# EAGLE design carte suiveur (EAGLE 5.12)
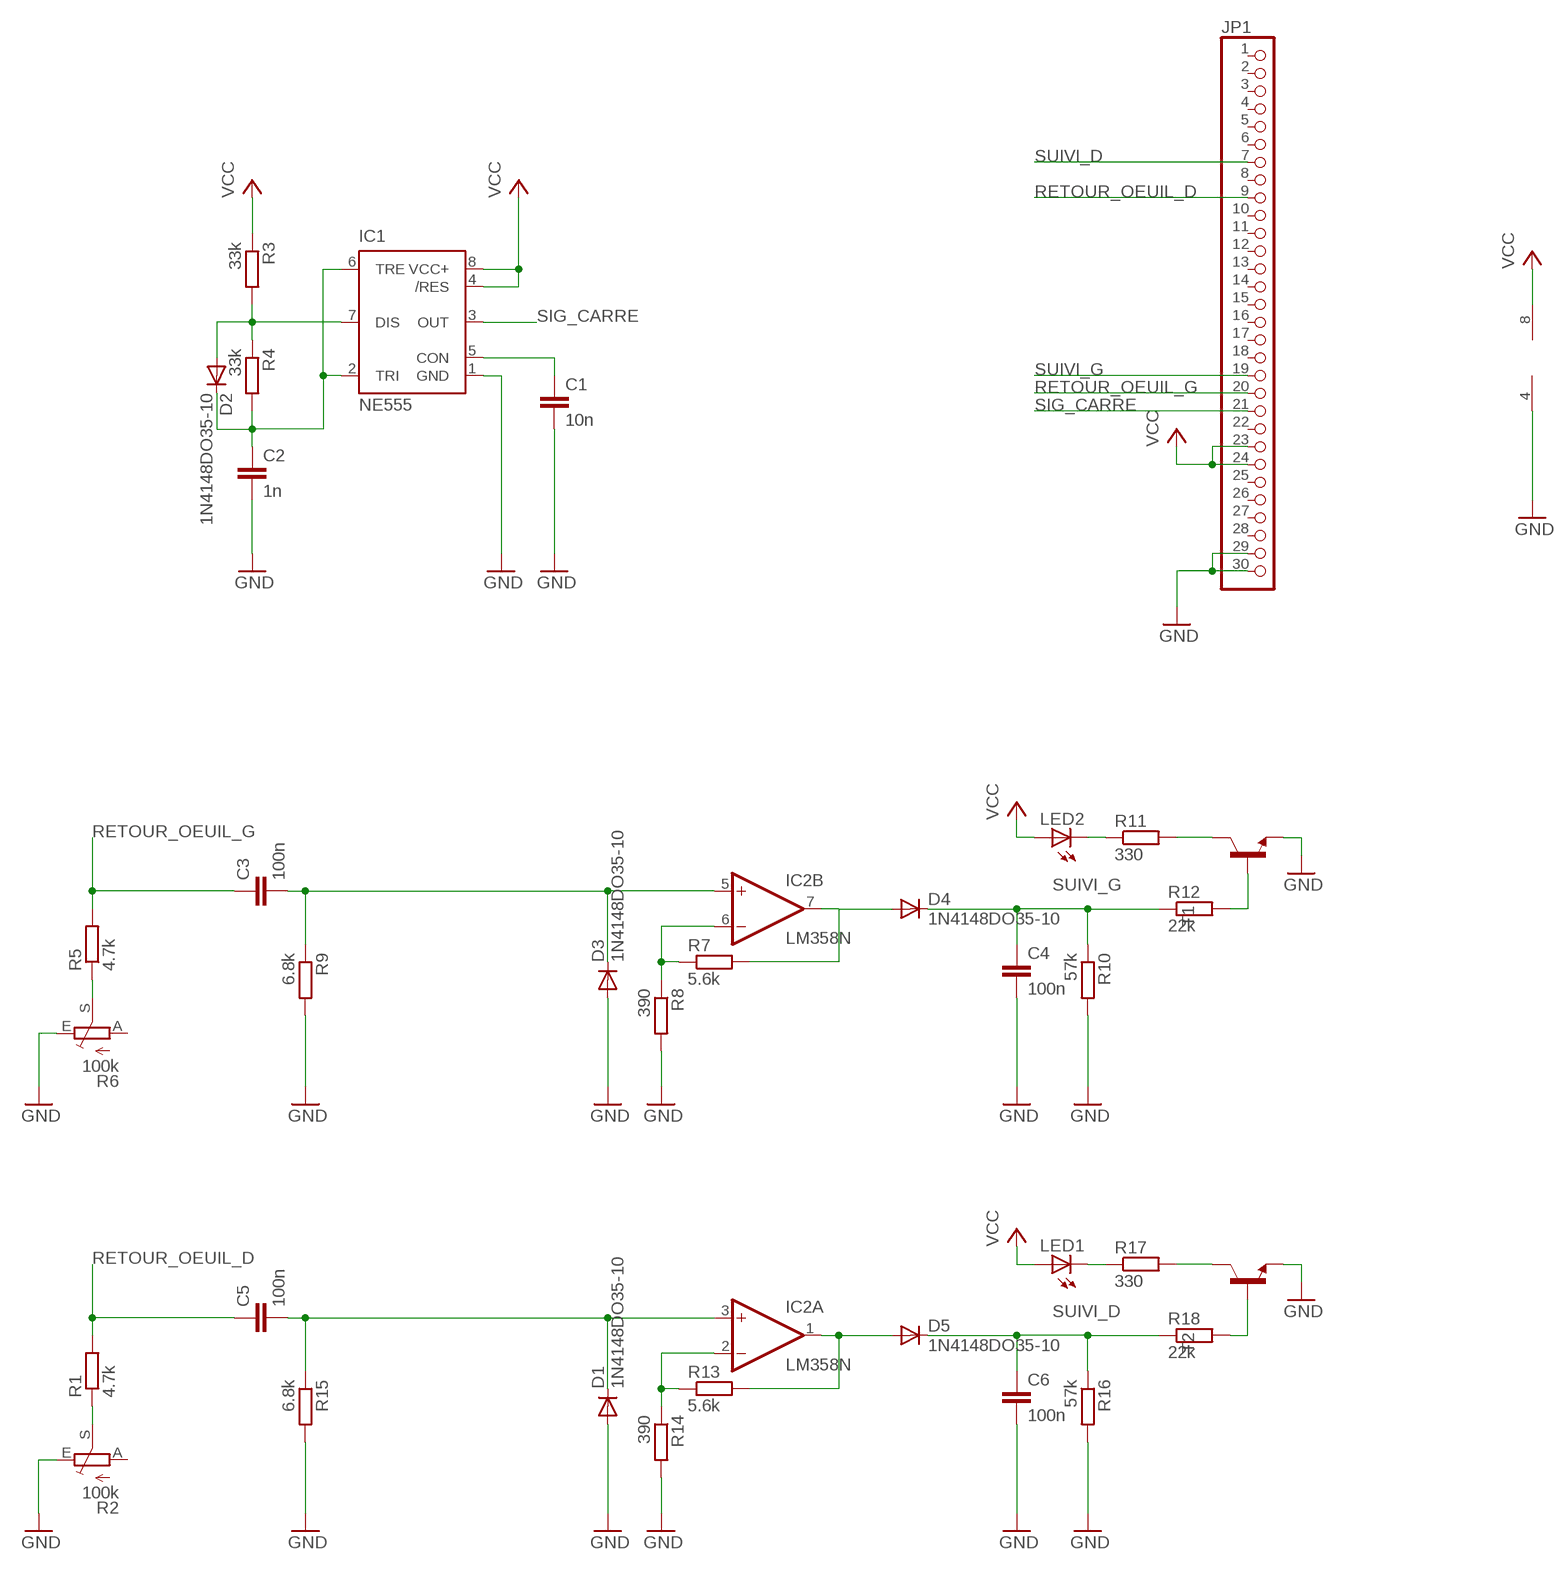
[diagram p0: schematic, sheet 1]

## Parts
C1  10n  C-EU025-025X050  [C025-025X050]
C2  1n  C-EU102-043X133  [C102-043X133]
C3  100n  C-EU025-025X050  [C025-025X050]
C4  100n  C-EU025-025X050  [C025-025X050]
C5  100n  C-EU025-025X050  [C025-025X050]
C6  100n  C-EU025-025X050  [C025-025X050]
D1  1N4148DO35-10  [DO35-10]
D2  1N4148DO35-10  [DO35-10]
D3  1N4148DO35-10  [DO35-10]
D4  1N4148DO35-10  [DO35-10]
D5  1N4148DO35-10  [DO35-10]
IC1  NE555  [DIL-08]
IC2  LM358N  [DIL08]
JP1  PINHD-1X30  [1X30]
LED1  LED3MM  [LED3MM]
LED2  LED3MM  [LED3MM]
R1  4.7k  R-EU_0207/10  [0207/10]
R2  100k  TRIM_EU-CA9V  [CA9V]
R3  33k  R-EU_0207/10  [0207/10]
R4  33k  R-EU_0207/10  [0207/10]
R5  4.7k  R-EU_0207/10  [0207/10]
R6  100k  TRIM_EU-CA9V  [CA9V]
R7  5.6k  R-EU_0207/10  [0207/10]
R8  390  R-EU_0207/10  [0207/10]
R9  6.8k  R-EU_0207/10  [0207/10]
R10  57k  R-EU_0207/10  [0207/10]
R11  330  R-EU_0207/10  [0207/10]
R12  22k  R-EU_0207/10  [0207/10]
R13  5.6k  R-EU_0207/10  [0207/10]
R14  390  R-EU_0207/10  [0207/10]
R15  6.8k  R-EU_0207/10  [0207/10]
R16  57k  R-EU_0207/10  [0207/10]
R17  330  R-EU_0207/10  [0207/10]
R18  22k  R-EU_0207/10  [0207/10]
T1  2N2222-NPN-TO92-EBC  [TO92-EBC]
T2  2N2222-NPN-TO92-EBC  [TO92-EBC]

## Nets
GND: C1.2 C2.2 C4.2 C6.2 D1.A D3.A IC1.1(GND) IC2.4(P:V-) JP1.29 JP1.30 R2.E R6.E R8.2 R9.2 R10.2 R14.2 R15.2 R16.2 T1.E T2.E
N$1: LED1.K(C) R17.1
N$2: D2.A IC1.7(DIS) R3.2 R4.1
N$3: C2.1 D2.C IC1.2(TRI) IC1.6(TRE) R4.2
N$4: C1.1 IC1.5(CON)
N$5: C5.2 D1.C IC2.3(A:+IN) R15.1
N$6: IC2.2(A:-IN) R13.1 R14.1
N$7: C3.2 D3.C IC2.5(B:+IN) R9.1
N$8: IC2.6(B:-IN) R7.1 R8.1
N$9: D4.A IC2.7(B:OUT) R7.2
N$10: R5.1 R6.S
N$12: D5.A IC2.1(A:OUT) R13.2
N$13: R1.1 R2.S
N$14: R11.2 T1.C
N$16: R17.2 T2.C
N$17: LED2.K(C) R11.1
N$18: R18.2 T2.B
N$19: R12.2 T1.B
RETOUR_OEUIL_D: C5.1 JP1.9 R1.2
RETOUR_OEUIL_G: C3.1 JP1.20 R5.2
SIG_CARRE: IC1.3(OUT) JP1.21
SUIVI_D: C6.1 D5.C JP1.7 R16.1 R18.1
SUIVI_G: C4.1 D4.C JP1.19 R10.1 R12.1
VCC: IC1.4(/RES) IC1.8(VCC+) IC2.8(P:V+) JP1.23 JP1.24 LED1.A LED2.A R3.1
Unconnected: JP1.1 JP1.2 JP1.3 JP1.4 JP1.5 JP1.6 JP1.8 JP1.10 JP1.11 JP1.12 JP1.13 JP1.14 JP1.15 JP1.16 JP1.17 JP1.18 JP1.22 JP1.25 JP1.26 JP1.27 JP1.28 R2.A R6.A

## Library data of the parts
C1-C6 = resistor:C-EU: CAPACITOR, European symbol
D1-D5 = diode:1N4148: DIODE high speed (Philips)
IC1 = st-microelectronics:NE555: General purpose bipolar Timer; MF: Arrow Electronics; MPN: NE555N; OC_FARNELL: 1467742; OC_NEWARK: 89K1486
IC2 = linear:LM358: OP AMP also LM158; LM258; LM2904 Source: http://cache.national.com/ds/LM/LM158.pdf
JP1 = pinhead:PINHD-1X30: PIN HEADER
LED1 LED2 = led:LED: LED OSRAM: - CHIPLED LG R971, LG N971, LY N971, LG Q971, LY Q971, LO R971, LY R971 LH N974, LH R974 LS Q976, LO Q976, LY Q976 LO Q996 - Hyper CHIPLED LW Q18S LB Q993, LB Q99A, LB R99A - SideLED LS A670, LO A670, LY A670, LG A670, LP A670 LB A673, LV A673, LT A673, LW A673 LH A674 LY A675 LS A676, LA A676, LO A676, LY A676, LW A676 LS A679, LY A679, LG A679 - Hyper Micro SIDELED® LS Y876, LA Y876, LO Y876, LY Y876 LT Y87S - SmartLED LW L88C, LW L88S LB L89C, LB L89S, LG L890 LS L89K, LO L89K, LY L89K LS L896, LA L896, LO L896, LY L896 - TOPLED LS T670, LO T670, LY T670, LG T670, LP T670 LSG T670, LSP T670, LSY T670, LOP T670, LYG T670 LG T671, LOG T671, LSG T671 LB T673, LV T673, LT T673, LW T673 LH T674 LS T676, LA T676, LO T676, LY T676, LB T676, LH T676, LSB T676, LW T676 LB T67C, LV T67C, LT T67C, LS T67K, LO T67K, LY T67K, LW E67C LS E67B, LA E67B, LO E67B, LY E67B, LB E67C, LV E67C, LT E67C LW T67C LS T679, LY T679, LG T679 LS T770, LO T770, LY T770, LG T770, LP T770 LB T773, LV T773, LT T773, LW T773 LH T774 LS E675, LA E675, LY E675, LS T675 LS T776, LA T776, LO T776, LY T776, LB T776 LHGB T686 LT T68C, LB T68C - Hyper Mini TOPLED® LB M676 - Mini TOPLED Santana® LG M470 LS M47K, LO M47K, LY M47K Source: http://www.osram.convergy.de LUXEON: - LUMILED® LXK2-PW12-R00, LXK2-PW12-S00, LXK2-PW14-U00, LXK2-PW14-V00 LXK2-PM12-R00, LXK2-PM12-S00, LXK2-PM14-U00 LXK2-PE12-Q00, LXK2-PE12-R00, LXK2-PE12-S00, LXK2-PE14-T00, LXK2-PE14-U00 LXK2-PB12-K00, LXK2-PB12-L00, LXK2-PB12-M00, LXK2-PB14-N00, LXK2-PB14-P00, LXK2-PB14-Q00 LXK2-PR12-L00, LXK2-PR12-M00, LXK2-PR14-Q00, LXK2-PR14-R00 LXK2-PD12-Q00, LXK2-PD12-R00, LXK2-PD12-S00 LXK2-PH12-R00, LXK2-PH12-S00 LXK2-PL12-P00, LXK2-PL12-Q00, LXK2-PL12-R00 Source: www.luxeon.com KINGBRIGHT: KA-3528ASYC Source: www.kingbright.com
R1 R3-R5 R7-R18 = resistor:R-EU_: RESISTOR, European symbol
R2 R6 = pot:TRIM_EU-: POTENTIOMETER
T1 T2 = transistor-neu-to92:*-NPN-: NPN Transistror

## Board
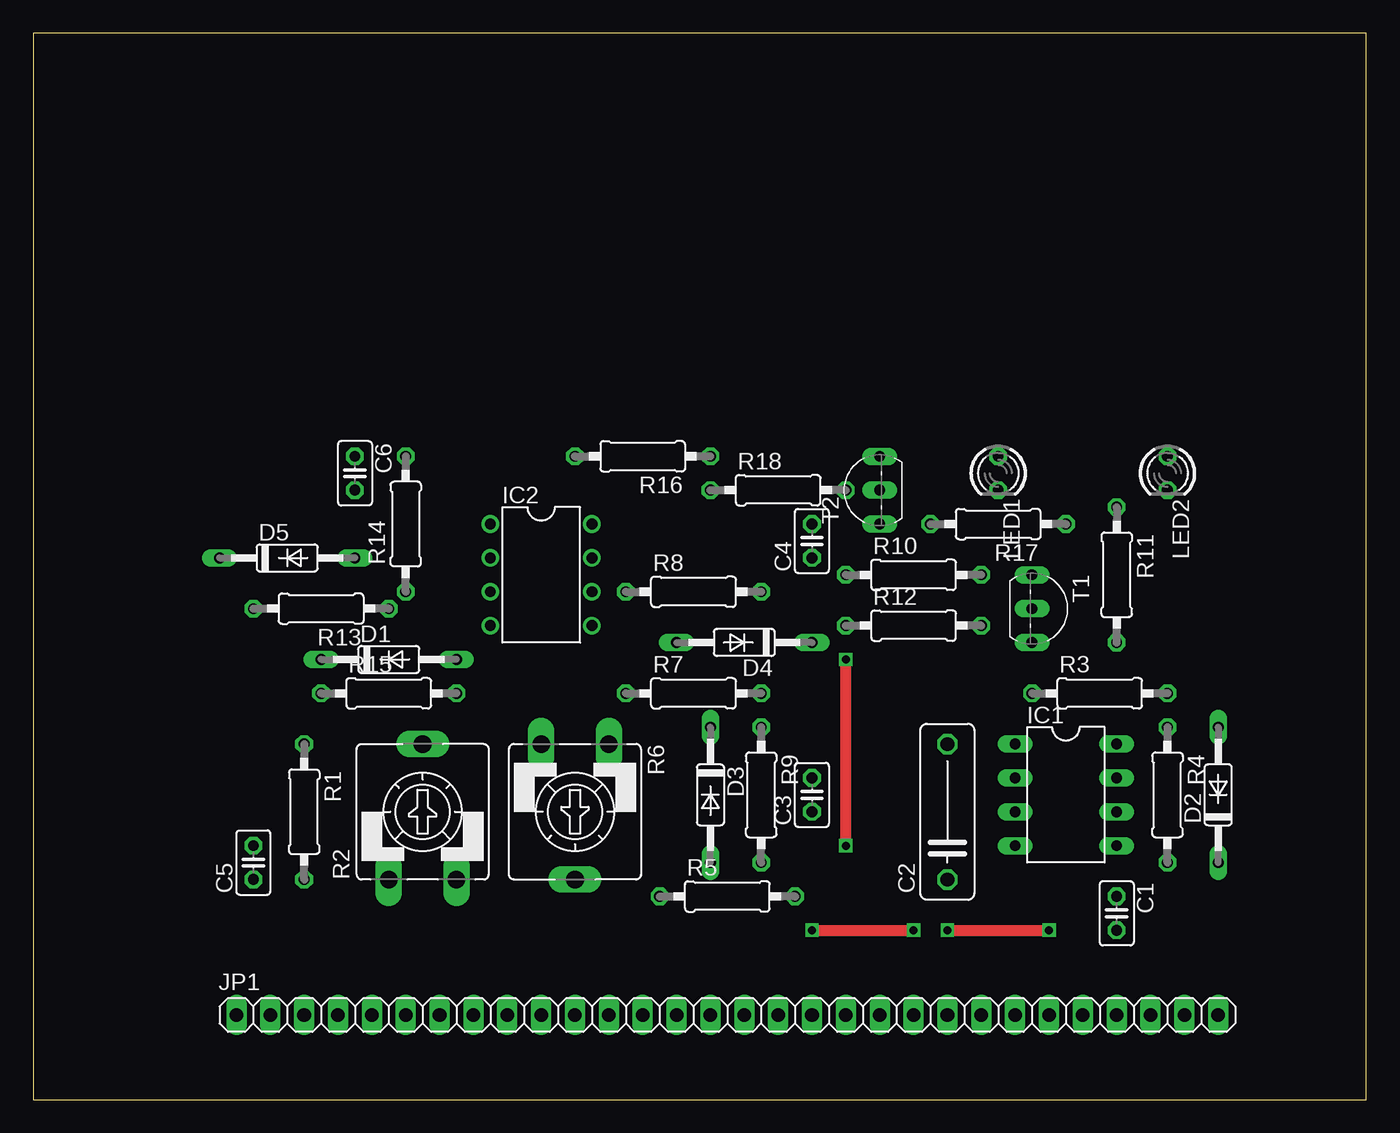
[diagram p1: board, top side]
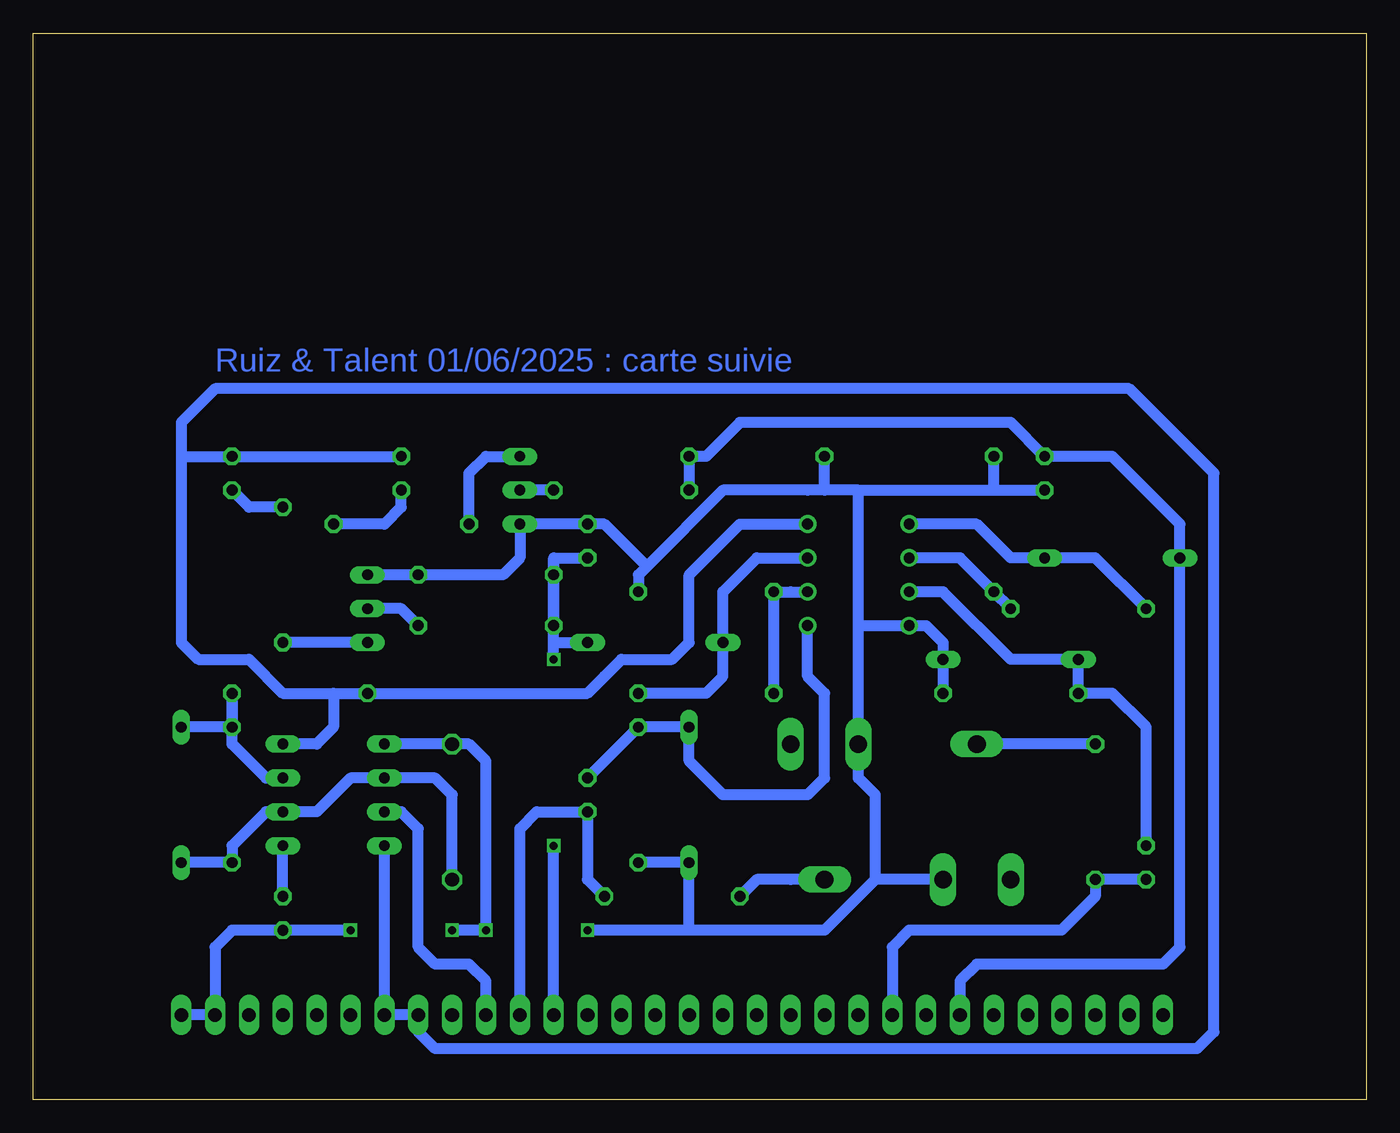
[diagram p2: board, bottom side, seen from below]

Size 100 x 80 mm. Coordinates in mm from the lower left corner, seen from the top.
Outline: 0,0 100,0 100,80 0,80 0,0
Copper layers (1*16): Top 0.035mm / dielectric 1.5mm / Bottom 0.035mm
Design rules "default": minimum track width 10mil, minimum drill 24mil, track to track 8mil, track to pad 8mil, pad to pad 8mil, via to via 8mil, smd to smd 8mil, copper to edge 40mil, drill to drill 8mil, minimum pad ring 10mil, minimum via ring 8mil, stop-mask expansion 4mil, vias tented up to drill 0mil, thermal gap 10mil

### Footprints (pad centres in the part's own frame; a part is rotated, then mirrored left to right if it is on the bottom)
C025-025X050 = drill 0.813 octagon: 1 -1.27,0; 2 1.27,0
C102-043X133 = drill 1.016 octagon: 1 -5.08,0; 2 5.08,0
DO35-10 = drill 0.813 long: A 5.08,0; C -5.08,0
DIL-08 = drill 0.813 long: 1 -3.81,-3.81; 2 -1.27,-3.81; 3 1.27,-3.81; 4 3.81,-3.81; 5 3.81,3.81; 6 1.27,3.81; 7 -1.27,3.81; 8 -3.81,3.81
DIL08 = drill 0.813 pad 1.27 round: 1 -3.81,-3.81; 2 -1.27,-3.81; 3 1.27,-3.81; 4 3.81,-3.81; 5 3.81,3.81; 6 1.27,3.81; 7 -1.27,3.81; 8 -3.81,3.81
1X30 = drill 1.016 long: 1 -36.83,0; 2 -34.29,0; 3 -31.75,0; 4 -29.21,0; 5 -26.67,0; 6 -24.13,0; 7 -21.59,0; 8 -19.05,0; 9 -16.51,0; 10 -13.97,0; 11 -11.43,0; 12 -8.89,0; 13 -6.35,0; 14 -3.81,0; 15 -1.27,0; 16 1.27,0; 17 3.81,0; 18 6.35,0; 19 8.89,0; 20 11.43,0; 21 13.97,0; 22 16.51,0; 23 19.05,0; 24 21.59,0; 25 24.13,0; 26 26.67,0; 27 29.21,0; 28 31.75,0; 29 34.29,0; 30 36.83,0
LED3MM = drill 0.813 octagon: A -1.27,0; K 1.27,0
0207/10 = drill 0.813 octagon: 1 -5.08,0; 2 5.08,0
CA9V = drill 1.321 long: A -2.54,-5.08; E 2.54,-5.08; S 0,5.08
TO92-EBC = drill 0.813 long: B 0,-1.27; C 2.54,-1.27; E -2.54,-1.27

### Placement (x,y rotation side)
C1  81.28,13.97 270 top
C2  68.58,21.59 90 top
C3  58.42,22.86 90 top
C4  58.42,41.91 90 top
C5  16.51,17.78 90 top
C6  24.13,46.99 270 top
D1  26.67,33.02 0 top
D2  88.9,22.86 90 top
D3  50.8,22.86 270 top
D4  53.34,34.29 180 top
D5  19.05,40.64 0 top
IC1  77.47,22.86 270 top
IC2  38.1,39.37 270 top
JP1  52.07,6.35 0 top
LED1  72.39,46.99 270 top
LED2  85.09,46.99 270 top
R1  20.32,21.59 270 top
R2  29.21,21.59 0 top
R3  80.01,30.48 0 top
R4  85.09,22.86 270 top
R5  52.07,15.24 0 top
R6  40.64,21.59 180 top
R7  49.53,30.48 0 top
R8  49.53,38.1 0 top
R9  54.61,22.86 270 top
R10  66.04,39.37 0 top
R11  81.28,39.37 270 top
R12  66.04,35.56 0 top
R13  21.59,36.83 180 top
R14  27.94,43.18 90 top
R15  26.67,30.48 0 top
R16  45.72,48.26 180 top
R17  72.39,43.18 180 top
R18  55.88,45.72 0 top
T1  76.2,36.83 270 top
T2  62.23,45.72 90 top

### Tracks (layer width: path | path; a pad name or v marks a point on that pad's centre or on a via)
GND  (via drill 0.6)
  Top 0.813: v68.58,12.7 v76.2,12.7 | v58.42,12.7 v66.04,12.7
  Bottom 0.813: R15.2 D1.A 31.75,34.29 33.02,35.56 IC2.4 38.1,35.56 | 38.1,34.29 38.1,35.56 | R6.E 38.1,34.29 | 38.1,24.13 R6.E | 38.1,24.13 R6.E | R9.2 D3.A 50.8,12.7 | R6.E 38.1,34.29 | 38.1,24.13 R6.E | 38.1,24.13 R6.E | 38.1,34.29 38.1,35.56 | 38.1,34.29 38.1,35.56 | JP1.30 JP1.29 86.36,11.43 85.09,12.7 C1.2 v76.2,12.7 | v68.58,12.7 v66.04,12.7 66.04,25.4 67.31,26.67 C2.2 IC1.1 | 50.8,12.7 40.64,12.7 38.1,15.24 36.83,16.51 | 50.8,12.7 v58.42,12.7 | 36.83,16.51 36.83,22.86 38.1,24.13 | 38.1,24.13 R6.E | 38.1,45.72 35.56,45.72 33.02,45.72 31.75,45.72 27.94,45.72 | T1.E R10.2 64.77,39.37 63.5,40.64 T2.E C4.2 57.15,43.18 53.98,40.01 | R2.E 36.83,16.51 | 38.1,45.72 40.64,45.72 | 40.64,45.72 41.91,45.72 48.26,45.72 53.98,40.01 | 53.98,40.01 54.61,39.37 R8.2 | C6.2 25.4,45.72 27.94,45.72 | 27.94,45.72 R14.2 | 40.64,45.72 R16.2 | 38.1,35.56 38.1,45.72
N$1
  Bottom 0.813: LED1.K 72.39,44.45 73.66,43.18 R17.1
N$2
  Bottom 0.813: D2.A R4.1 R3.2 85.09,26.67 82.55,24.13 IC1.7
N$3
  Bottom 0.813: D2.C R4.2 85.09,19.05 82.55,21.59 IC1.6 80.01,21.59 78.74,21.59 76.2,24.13 IC1.2 69.85,24.13 68.58,22.86 C2.1
N$4
  Bottom 0.813: C1.1 IC1.5
N$5
  Bottom 0.813: C5.2 16.51,27.94 19.05,30.48 R15.1 D1.C 26.67,33.02 31.75,38.1 IC2.3
N$6
  Bottom 0.813: IC2.2 30.48,40.64 R14.1 R13.1
N$7
  Bottom 0.813: C3.2 R9.1 D3.C 50.8,25.4 48.26,22.86 41.91,22.86 40.64,24.13 40.64,30.48 41.91,31.75 IC2.5
N$8
  Bottom 0.813: R8.1 R7.1 R8.1 | R8.1 43.18,38.1 IC2.6
N$9
  Bottom 0.813: IC2.7 45.72,40.64 48.26,38.1 D4.A 48.26,31.75 49.53,30.48 R7.2
N$10
  Bottom 0.813: R6.S 43.18,16.51 45.72,16.51 R5.1
N$12
  Bottom 0.813: R13.2 20.32,40.64 D5.A 26.67,40.64 29.21,43.18 IC2.1
N$13
  Bottom 0.813: R1.1 R2.S
N$14
  Bottom 0.813: T1.C R11.2
N$16
  Bottom 0.813: T2.C 66.04,48.26 67.31,46.99 R17.2
N$17
  Bottom 0.813: R11.1 83.82,44.45 LED2.K
N$18
  Bottom 0.813: R18.2 T2.B
N$19
  Bottom 0.813: R12.2 72.39,36.83 T1.B
RETOUR_OEUIL_D
  Bottom 0.813: JP1.9 35.56,11.43 34.29,12.7 22.86,12.7 20.32,15.24 R1.2 C5.1
RETOUR_OEUIL_G
  Bottom 0.813: JP1.20 63.5,20.32 62.23,21.59 C3.1 58.42,16.51 R5.2
SIG_CARRE
  Bottom 0.813: IC1.3 72.39,21.59 71.12,20.32 71.12,11.43 69.85,10.16 67.31,10.16 66.04,8.89 JP1.21
SUIVI_D
  Bottom 0.813: JP1.7 30.48,8.89 29.21,10.16 15.24,10.16 13.97,11.43 D5.C 13.97,43.18 19.05,48.26 C6.1 26.67,50.8 46.99,50.8 49.53,48.26 R16.1 R18.1
SUIVI_G  (via drill 0.6)
  Top 0.813: v60.96,19.05 v60.96,33.02
  Bottom 0.813: R12.1 R10.1 60.96,40.64 | 60.96,40.64 C4.1 | JP1.19 v60.96,19.05 | v60.96,33.02 60.96,34.29 | 60.96,34.29 60.96,40.64 | 60.96,34.29 D4.C
VCC
  Bottom 0.813: IC1.8 78.74,26.67 77.47,27.94 77.47,30.48 | IC1.4 JP1.24 JP1.23 71.12,5.08 69.85,3.81 12.7,3.81 11.43,5.08 11.43,46.99 17.78,53.34 86.36,53.34 88.9,50.8 88.9,48.26 | IC2.8 44.45,43.18 46.99,43.18 50.8,39.37 50.8,34.29 52.07,33.02 55.88,33.02 57.15,31.75 58.42,30.48 R3.1 77.47,30.48 | 77.47,30.48 81.28,30.48 83.82,33.02 87.63,33.02 88.9,34.29 88.9,48.26 | LED1.A LED2.A 88.9,48.26

### Text on the board
Bottom: Ruiz & Talent 01/06/2025 : carte suivie